# EAGLE design CANMosfetExtension (EAGLE 9.6.2)
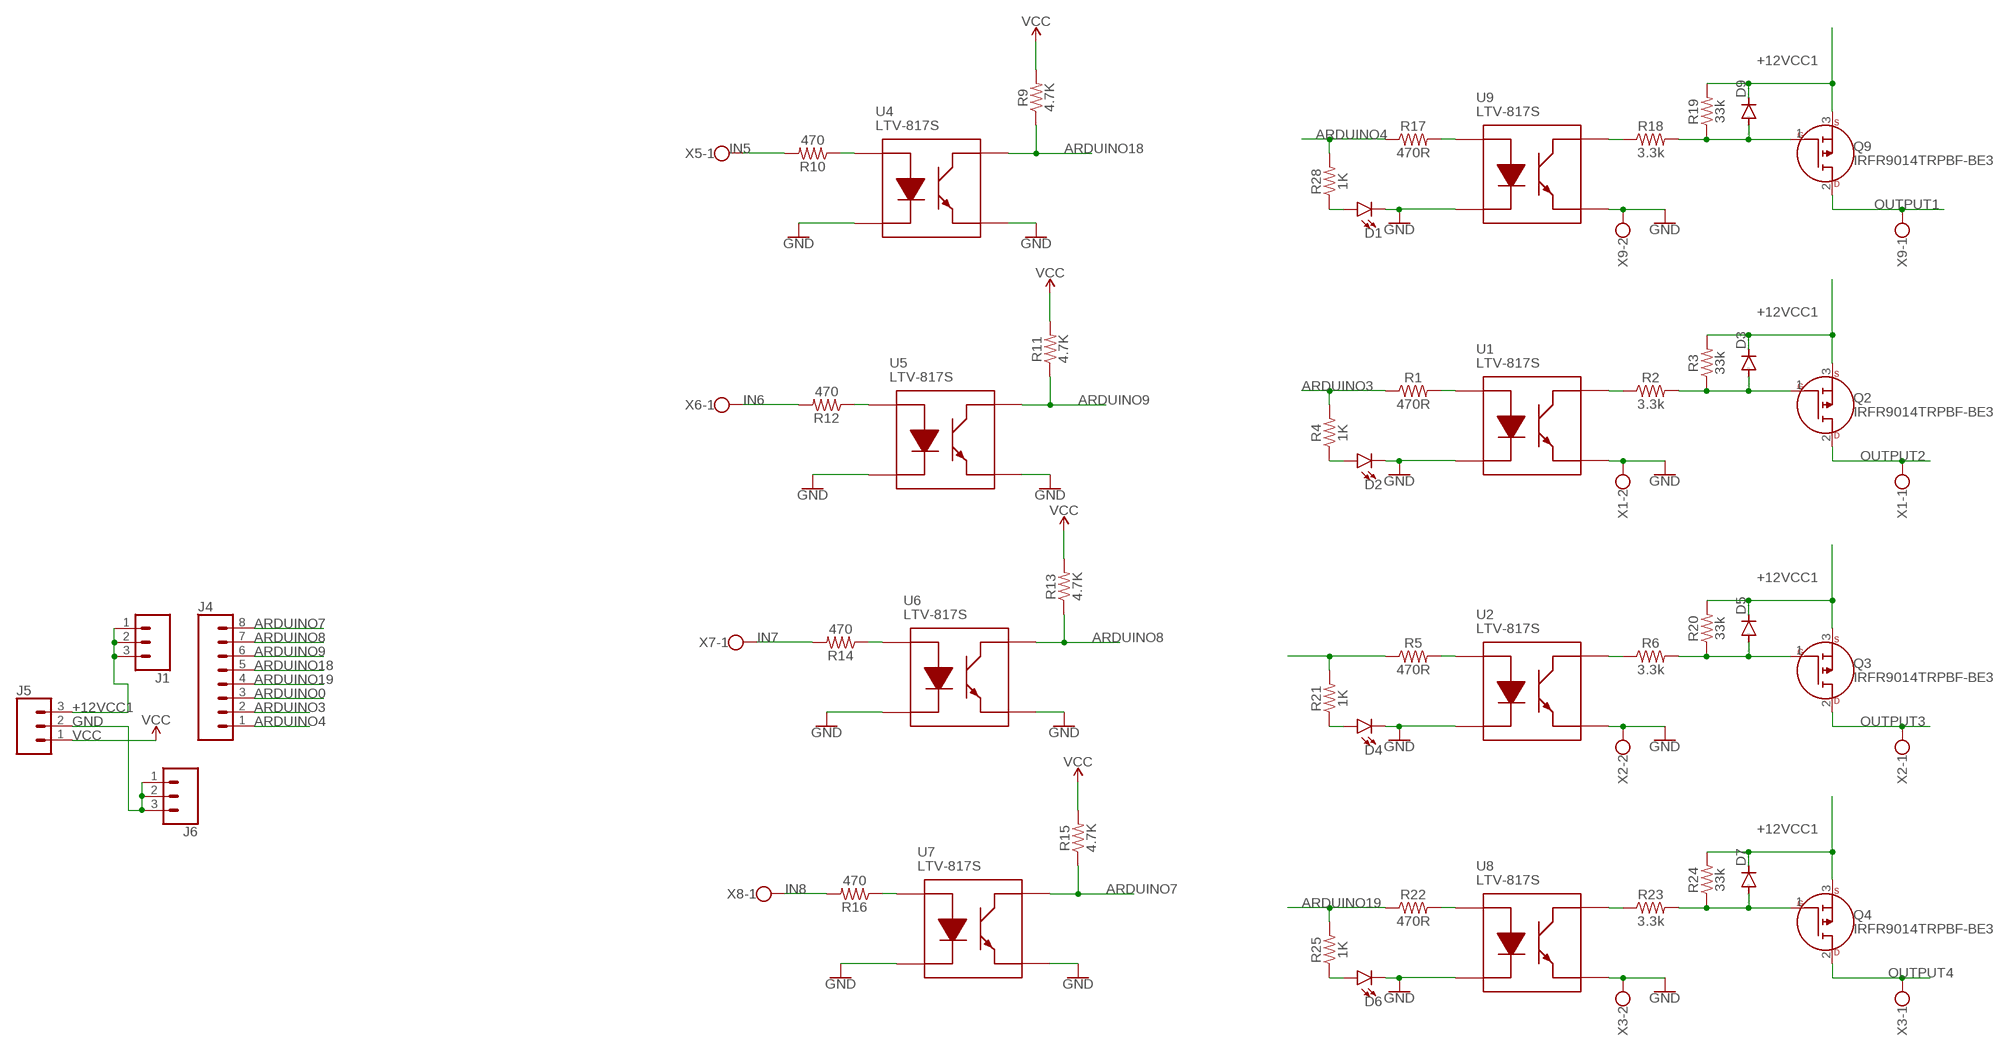
[diagram p0: schematic, sheet 1]

## Parts
D1  LED0603  [LED-0603]
D2  LED0603  [LED-0603]
D3  DIODE-SOD123  [SOD123]
D4  LED0603  [LED-0603]
D5  DIODE-SOD123  [SOD123]
D6  LED0603  [LED-0603]
D7  DIODE-SOD123  [SOD123]
D9  DIODE-SOD123  [SOD123]
J1  CONN_03LOCK  [1X03_LOCK]
J4  CONN_08LOCK  [1X08_LOCK]
J5  CONN_03LOCK  [1X03_LOCK]
J6  CONN_03LOCK  [1X03_LOCK]
Q2  IRFR9014TRPBF-BE3  [IRFR9014TRPBFBE3]
Q3  IRFR9014TRPBF-BE3  [IRFR9014TRPBFBE3]
Q4  IRFR9014TRPBF-BE3  [IRFR9014TRPBFBE3]
Q9  IRFR9014TRPBF-BE3  [IRFR9014TRPBFBE3]
R1  470R  1KOHM-0603-1/10W-1%  [0603]
R2  3.3k  1KOHM-0603-1/10W-1%  [0603]
R3  33k  1KOHM-0603-1/10W-1%  [0603]
R4  1K  1KOHM-0603-1/10W-1%  [0603]
R5  470R  1KOHM-0603-1/10W-1%  [0603]
R6  3.3k  1KOHM-0603-1/10W-1%  [0603]
R9  4.7K  1KOHM-0603-1/10W-1%  [0603]
R10  470  1KOHM-0603-1/10W-1%  [0603]
R11  4.7K  1KOHM-0603-1/10W-1%  [0603]
R12  470  1KOHM-0603-1/10W-1%  [0603]
R13  4.7K  1KOHM-0603-1/10W-1%  [0603]
R14  470  1KOHM-0603-1/10W-1%  [0603]
R15  4.7K  1KOHM-0603-1/10W-1%  [0603]
R16  470  1KOHM-0603-1/10W-1%  [0603]
R17  470R  1KOHM-0603-1/10W-1%  [0603]
R18  3.3k  1KOHM-0603-1/10W-1%  [0603]
R19  33k  1KOHM-0603-1/10W-1%  [0603]
R20  33k  1KOHM-0603-1/10W-1%  [0603]
R21  1K  1KOHM-0603-1/10W-1%  [0603]
R22  470R  1KOHM-0603-1/10W-1%  [0603]
R23  3.3k  1KOHM-0603-1/10W-1%  [0603]
R24  33k  1KOHM-0603-1/10W-1%  [0603]
R25  1K  1KOHM-0603-1/10W-1%  [0603]
R28  1K  1KOHM-0603-1/10W-1%  [0603]
U1  LTV-817S  [SOP254P1016X460-4N]
U2  LTV-817S  [SOP254P1016X460-4N]
U4  LTV-817S  [SOP254P1016X460-4N]
U5  LTV-817S  [SOP254P1016X460-4N]
U6  LTV-817S  [SOP254P1016X460-4N]
U7  LTV-817S  [SOP254P1016X460-4N]
U8  LTV-817S  [SOP254P1016X460-4N]
U9  LTV-817S  [SOP254P1016X460-4N]
X1  W237-102  [W237-102]
X2  W237-102  [W237-102]
X3  W237-102  [W237-102]
X5  W237-102  [W237-102]
X6  W237-102  [W237-102]
X7  W237-102  [W237-102]
X8  W237-102  [W237-102]
X9  W237-102  [W237-102]

## Nets
+12VCC1: D3.C D5.C D7.C D9.C J1.1 J1.2 J1.3 J5.3 Q2.3(D) Q3.3(D) Q4.3(D) Q9.3(D) R3.2 R19.2 R20.2 R24.2
ARDUINO0: J4.3 R5.1 R21.2
ARDUINO3: J4.2 R1.1 R4.2
ARDUINO4: J4.1 R17.1 R28.2
ARDUINO7: J4.8 R15.1 U7.4(COLLECTOR)
ARDUINO8: J4.7 R13.1 U6.4(COLLECTOR)
ARDUINO9: J4.6 R11.1 U5.4(COLLECTOR)
ARDUINO18: J4.5 R9.1 U4.4(COLLECTOR)
ARDUINO19: J4.4 R22.1 R25.2
GND: D1.C D2.C D4.C D6.C J5.2 J6.1 J6.2 J6.3 U1.2(CATHODE) U1.3(EMITTER) U2.2(CATHODE) U2.3(EMITTER) U4.2(CATHODE) U4.3(EMITTER) U5.2(CATHODE) U5.3(EMITTER) U6.2(CATHODE) U6.3(EMITTER) U7.2(CATHODE) U7.3(EMITTER) U8.2(CATHODE) U8.3(EMITTER) U9.2(CATHODE) U9.3(EMITTER) X1.2 X2.2 X3.2 X9.2
IN5: R10.2 X5.1
IN6: R12.2 X6.1
IN7: R14.2 X7.1
IN8: R16.2 X8.1
N$1: R18.1 U9.4(COLLECTOR)
N$2: R1.2 U1.1(ANODE)
N$3: R2.1 U1.4(COLLECTOR)
N$4: R5.2 U2.1(ANODE)
N$5: D3.A Q2.1(G) R2.2 R3.1
N$7: D2.A R4.1
N$8: R10.1 U4.1(ANODE)
N$9: R17.2 U9.1(ANODE)
N$10: R12.1 U5.1(ANODE)
N$11: D9.A Q9.1(G) R18.2 R19.1
N$12: R14.1 U6.1(ANODE)
N$13: R6.1 U2.4(COLLECTOR)
N$14: R16.1 U7.1(ANODE)
N$15: D5.A Q3.1(G) R6.2 R20.1
N$16: D4.A R21.1
N$17: R22.2 U8.1(ANODE)
N$18: R23.1 U8.4(COLLECTOR)
N$19: D7.A Q4.1(G) R23.2 R24.1
N$20: D6.A R25.1
N$33: D1.A R28.1
OUTPUT1: Q9.2(S) X9.1
OUTPUT2: Q2.2(S) X1.1
OUTPUT3: Q3.2(S) X2.1
OUTPUT4: Q4.2(S) X3.1
VCC: J5.1 R9.2 R11.2 R13.2 R15.2
Unconnected: X5.2 X6.2 X7.2 X8.2

## Library data of the parts
D1 D2 D4 D6 = SparkFun-LED:LED: LED (Generic) Standard schematic elements and footprints for 5mm, 3mm, 1206, and 0603 sized LEDs. Generic LEDs with no color specified.
D3 D5 D7 D9 = diode:DIODE-: DIODE
J1 J5 J6 = SparkFun-Connectors:CONN_03: Multi connection point. Often used as Generic Header-pin footprint for 0.1 inch spaced/style header connections On any of the 0.1 inch spaced packages, you can populate with these: Break Away Headers - Straight <https://www.sparkfun.com/products/116> (PRT-00116) Break Away Male Headers - Right Angle <https://www.sparkfun.com/products/553> (PRT-00553) Female Headers <https://www.sparkfun.com/products/115> (PRT-00115) Break Away Headers - Machine Pin <https://www.sparkfun.com/products/117> (PRT-00117) Break Away Female Headers - Swiss Machine Pin <https://www.sparkfun.com/products/743> (PRT-00743) Stackable Header - 3 Pin (Female, 0.1") <https://www.sparkfun.com/products/13875> (PRT-13875) For SCREWTERMINALS and SPRING TERMINALS visit here: Screw Terimnals on SparkFun.com <https://www.sparkfun.com/search/results?term=Screw+Terminals> (5mm/3.5mm/2.54mm spacing) This device is also useful as a general connection point to wire up your design to another part of your project. Our various solder wires solder well into these plated through hole pads. Hook-Up Wire - Assortment (Stranded, 22 AWG) <https://www.sparkfun.com/products/11375> (PRT-11375) Hook-Up Wire - Assortment (Solid Core, 22 AWG) <https://www.sparkfun.com/products/11367> (PRT-11367) View the entire wire category on our website here <https://www.sparkfun.com/categories/141> Special notes: Molex polarized connector foot print use with SKU : PRT-08232 with associated crimp pins and housings.
J4 = SparkFun-Connectors:CONN_08: Multi connection point. Often used as Generic Header-pin footprint for 0.1 inch spaced/style header connections On any of the 0.1 inch spaced packages, you can populate with these: Break Away Headers - Straight <https://www.sparkfun.com/products/116> (PRT-00116) Break Away Male Headers - Right Angle <https://www.sparkfun.com/products/553> (PRT-00553) Female Headers <https://www.sparkfun.com/products/115> (PRT-00115) Break Away Headers - Machine Pin <https://www.sparkfun.com/products/117> (PRT-00117) Break Away Female Headers - Swiss Machine Pin <https://www.sparkfun.com/products/743> (PRT-00743) Arduino Stackable Header - 8 Pin <https://www.sparkfun.com/products/9279> (PRT-09279) For SCREWTERMINALS and SPRING TERMINALS visit here: Screw Terimnals on SparkFun.com <https://www.sparkfun.com/search/results?term=Screw+Terminals> (5mm/3.5mm/2.54mm spacing) This device is also useful as a general connection point to wire up your design to another part of your project. Our various solder wires solder well into these plated through hole pads. Hook-Up Wire - Assortment (Stranded, 22 AWG) <https://www.sparkfun.com/products/11375> (PRT-11375) Hook-Up Wire - Assortment (Solid Core, 22 AWG) <https://www.sparkfun.com/products/11367> (PRT-11367) View the entire wire category on our website here <https://www.sparkfun.com/categories/141> Special notes: Molex polarized connector foot print use with SKU : PRT-08231 with associated crimp pins and housings. 1MM SMD Version SKU: PRT-10208 NOTES ON THE VARIANTS LOCK and LOCK_LONGPADS... This footprint was designed to help hold the alignment of a through-hole component (i.e. 6-pin header) while soldering it into place. You may notice that each hole has been shifted either up or down by 0.005 of an inch from it's more standard position (which is a perfectly straight line). This slight alteration caused the pins (the squares in the middle) to touch the edges of the holes. Because they are alternating, it causes a "brace" to hold the component in place. 0.005 has proven to be the perfect amount of "off-center" position when using our standard breakaway headers. Although looks a little odd when you look at the bare footprint, once you have a header in there, the alteration is very hard to notice. Also,if you push a header all the way into place, it is covered up entirely on the bottom side.
Q2-Q4 Q9 = SamacSys_Parts:IRFR9014TRPBF-BE3: MOSFET 60V P-CH HEXFET MOSFET D Source: Datasheet; DESCRIPTION: MOSFET 60V P-CH HEXFET MOSFET D; HEIGHT: 2.38mm; MANUFACTURER_NAME: Vishay; MANUFACTURER_PART_NUMBER: IRFR9014TRPBF-BE3; MOUSER_PART_NUMBER: 78-IRFR9014TRPBF-BE3; MOUSER_PRICE-STOCK: https://www.mouser.co.uk/ProductDetail/Vishay-Siliconix/IRFR9014TRPBF-BE3?qs=7MVldsJ5UaztV2jQZzH2pA%3D%3D
R1-R6 R9-R25 R28 = SparkFun-Resistors:1KOHM: 1kΩ resistor A resistor is a passive two-terminal electrical component that implements electrical resistance as a circuit element. Resistors act to reduce current flow, and, at the same time, act to lower voltage levels within circuits. - Wikipedia; PROD_ID: RES-07856; VALUE: 1k
U1 U2 U4-U9 = SamacSys_Parts:LTV-817S: Optocoupler Transistor Output, 35V, SMD4 Lite-On LTV-817S DC Input Transistor Output Optocoupler, Surface Mount, 4-Pin SMD Source: Datasheet <http://optoelectronics.liteon.com/upload/download/DS-70-96-0016/LTV-8X7 series 201610 .pdf>; DESCRIPTION: Optocoupler Transistor Output, 35V, SMD4 Lite-On LTV-817S DC Input Transistor Output Optocoupler, Surface Mount, 4-Pin SMD; HEIGHT: 4.6mm; MANUFACTURER_NAME: Lite-On; MANUFACTURER_PART_NUMBER: LTV-817S; MOUSER_PART_NUMBER: 859-LTV-817S; MOUSER_PRICE-STOCK: https://www.mouser.co.uk/ProductDetail/Lite-On/LTV-817S?qs=XpF7qU%252BvLkWYeWEC0OckNQ%3D%3D
X1-X3 X5-X9 = con-wago-500:W237-102: WAGO SCREW CLAMP; MPN: 237-102; OC_FARNELL: unknown; OC_NEWARK: 70K9898

## Net classes
0 default: width 0.305 mm

## Board
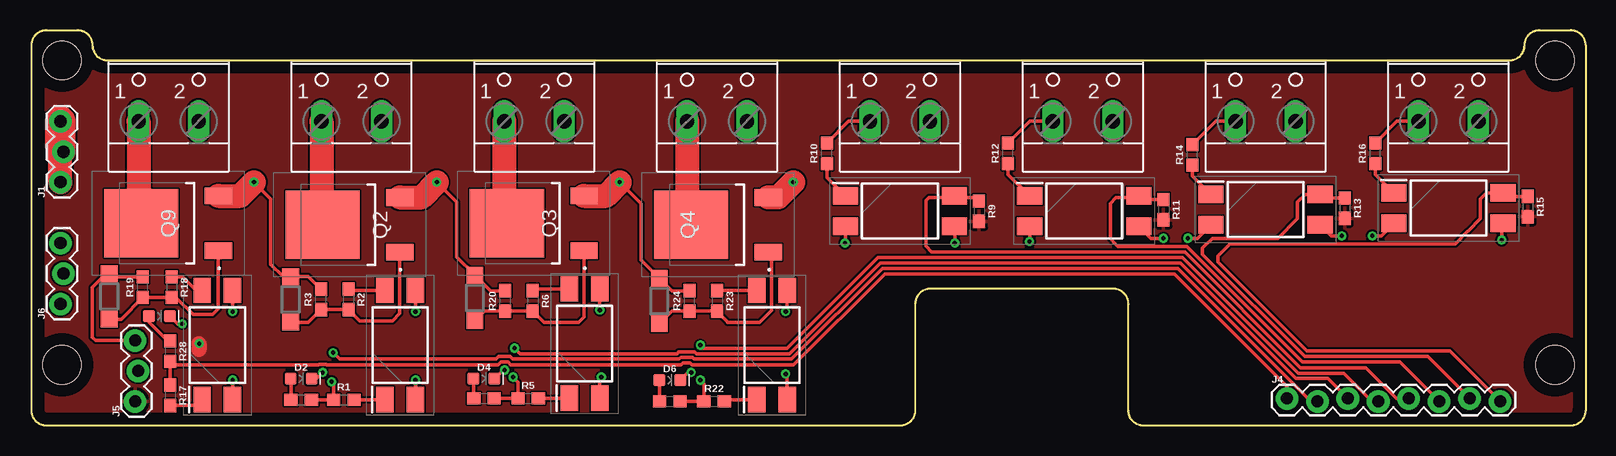
[diagram p1: board, top side]
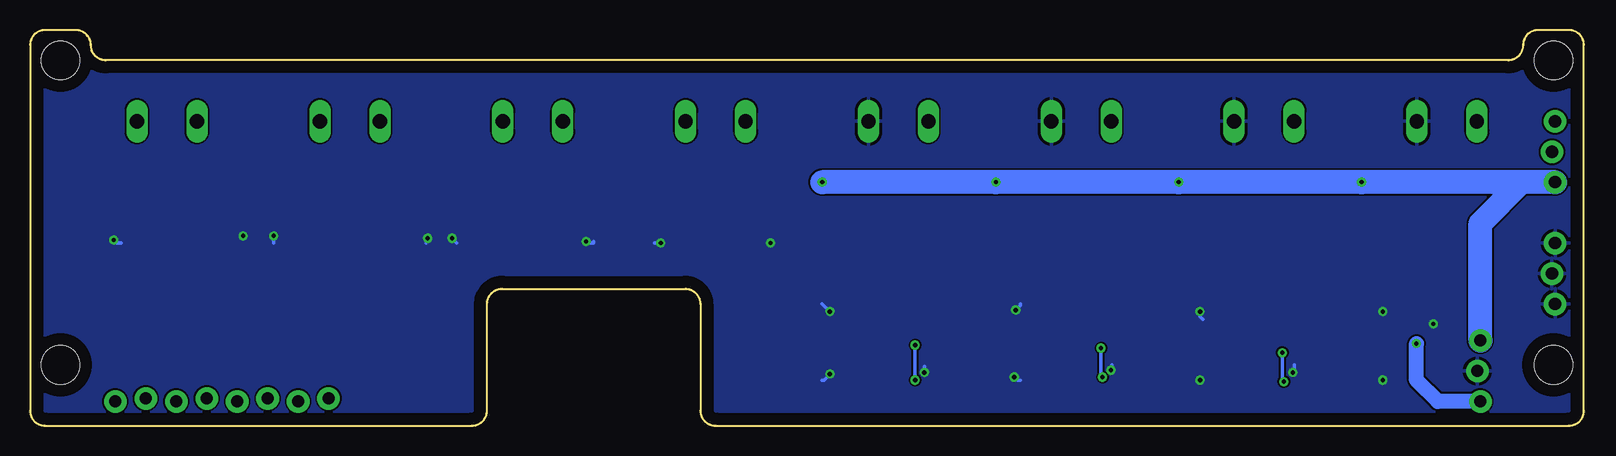
[diagram p2: board, bottom side, seen from below]

Size 129.54 x 33.02 mm. Coordinates in mm from the lower left corner, seen from the top.
Outline: 72.39,0 1.27,0 arc-90 0,1.27 0,31.75 arc-90 1.27,33.02 3.81,33.02 arc-90 5.08,31.75 arc90 6.35,30.48 123.19,30.48 arc90 124.46,31.75 arc-90 125.73,33.02 128.27,33.02 arc-90 129.54,31.75 129.54,1.27 arc-90 128.27,0 92.71,0 arc-90 91.44,1.27 91.44,10.16 arc90 90.17,11.43 74.93,11.43 arc90 73.66,10.16 73.66,1.27 arc-90 72.39,0
Copper layers (1*16): Top 0.035mm / dielectric 1.5mm / Bottom 0.035mm
Design rules "default": minimum track width 6mil, minimum drill 0.35mm, track to track 6mil, track to pad 6mil, pad to pad 6mil, via to via 6mil, smd to smd 6mil, copper to edge 40mil, drill to drill 6mil, minimum pad ring 10mil, minimum via ring 8mil, stop-mask expansion 4mil, vias tented up to drill 0mil, thermal gap 10mil
Holes 3.2 mm at 2.54,30.48 2.54,5.08 127,5.08 127,30.48

### Footprints (pad centres in the part's own frame; a part is rotated, then mirrored left to right if it is on the bottom)
LED-0603 = smd 1 x 1: A -0.877,0; C 0.877,0
SOD123 = smd 1.4 x 1.4: A 1.9,0; C -1.9,0
1X03_LOCK = drill 1.016 pad 1.88: 1 0,0.127; 2 2.54,-0.127; 3 5.08,0.127
1X08_LOCK = drill 1.016 pad 1.88: 1 0,0.127; 2 2.54,-0.127; 3 5.08,0.127; 4 7.62,-0.127; 5 10.16,0.127; 6 12.7,-0.127; 7 15.24,0.127; 8 17.78,-0.127
IRFR9014TRPBFBE3 = smd 1.397 x 2.286: 1 -2.286,-6.435; 3 2.286,-6.435 | smd 5.69 x 6.18: 2 0,0
0603 = smd 1.1 x 1: 1 -0.85,0; 2 0.85,0
SOP254P1016X460-4N = smd 2.1 x 1.45: 1 -4.55,1.27; 2 -4.55,-1.27; 3 4.55,-1.27; 4 4.55,1.27
W237-102 = drill 1.194 long: 1 -2.5,-1.27; 2 2.5,-1.27

### Placement (x,y rotation side)
D1  10.67,9.14 0 top
D2  22.48,3.94 0 top
D3  21.59,10.54 270 top
D4  37.72,3.94 0 top
D5  36.96,10.67 270 top
D6  53.21,3.81 0 top
D7  52.32,10.41 270 top
D9  6.48,10.79 270 top
J1  2.54,20.32 90 top
J4  104.65,2.16 0 top
J5  8.76,2.03 90 top
J6  2.54,10.16 90 top
Q2  24.26,16.76 90 top
Q3  39.62,16.89 90 top
Q4  54.99,16.76 90 top
Q9  9.14,16.89 90 top
R1  26.04,2.16 0 top
R2  26.42,10.54 270 top
R3  24.13,10.54 90 top
R4  22.48,2.16 0 top
R5  41.4,2.29 0 top
R6  41.78,10.41 270 top
R9  78.99,17.91 270 top
R10  66.29,22.73 90 top
R11  94.36,18.03 270 top
R12  81.41,22.73 90 top
R13  109.47,18.16 270 top
R14  96.77,22.61 90 top
R15  124.71,18.29 270 top
R16  112.01,22.73 90 top
R17  11.56,2.54 270 top
R18  11.68,11.56 270 top
R19  9.27,11.56 90 top
R20  39.5,10.41 90 top
R21  37.72,2.29 0 top
R22  56.9,2.03 0 top
R23  57.15,10.41 270 top
R24  54.86,10.41 90 top
R25  53.21,2.03 0 top
R28  11.56,6.22 270 top
U1  30.73,6.73 90 top
U2  46.1,6.86 90 top
U4  72.39,17.91 0 top
U5  87.76,17.91 0 top
U6  102.87,18.03 0 top
U7  118.11,18.16 0 top
U8  61.72,6.73 90 top
U9  15.49,6.73 90 top
X1  26.67,26.67 0 top
X2  41.91,26.67 0 top
X3  57.15,26.67 0 top
X5  72.39,26.67 0 top
X6  87.63,26.67 0 top
X7  102.87,26.67 0 top
X8  118.11,26.67 0 top
X9  11.43,26.67 0 top

### Tracks (layer width: path | path; a pad name or v marks a point on that pad's centre or on a via)
+12VCC1  (via drill 0.35)
  Top 0.305: 6.6,12.57 6.77,12.41 R19.2 9.02,12.66 | 6.6,12.57 D9.C | R3.2 23.08,12.44 D3.C 20.96,12.44 19.94,13.46 19.94,18.92 v18.54,20.32 | R20.2 38.26,11.26 D5.C 35.43,14.09 35.43,18.67 v33.78,20.32 | R24.2 53.37,11.26 D7.C 50.8,13.84 50.8,18.54 v49.02,20.32 | J5.3 5.33,7.11 5.08,7.37 5.08,11.56 6.09,12.57 6.6,12.57
  Top 2: J1.1 2.41,22.61 J1.2 2.41,23.11 J1.3 | v63.5,20.32 62.23,19.05 Q4.3 | Q3.3 47.88,19.18 v49.02,20.32 | Q2.3 32.51,19.05 v33.78,20.32 | Q9.3 17.4,19.18 v18.54,20.32
  Top 2.54: J1.3 2.41,23.37
  Bottom 2: J5.3 8.64,16.89 5.21,20.32 J1.1 v18.54,20.32 v33.78,20.32 v49.02,20.32 v63.5,20.32
ARDUINO0  (via drill 0.35)
  Top 0.305: J4.3 108.08,3.94 105.4,3.94 95.75,13.59 70.75,13.59 63.18,6.02 55.42,6.02 55.27,6.17 53.95,6.17 53.8,6.02 40.72,6.02 v40.26,6.48 | v40.13,4.06 40.55,3.64 R5.1 R21.2
  Bottom 0.305: v40.26,6.48 40.26,4.19 v40.13,4.06
ARDUINO3  (via drill 0.35)
  Top 0.305: J4.2 106.66,2.03 95.56,13.13 70.94,13.13 63.37,5.56 55.23,5.56 55.08,5.71 54.14,5.71 53.99,5.56 40.12,5.56 39.9,5.78 38.95,5.78 38.73,5.56 25.68,5.56 v25.15,6.1 | v25.02,3.68 25.18,3.52 R1.1 R4.2
  Bottom 0.305: v25.15,6.1 25.15,3.81 v25.02,3.68
ARDUINO4
  Top 0.305: J4.1 104.65,3.3 95.28,12.68 71.13,12.68 63.54,5.08 55.07,5.08 54.89,5.26 54.33,5.26 54.15,5.08 39.95,5.08 39.71,5.33 39.14,5.33 38.9,5.08 24.59,5.08 24.54,5.13 23.97,5.13 23.93,5.08 11.85,5.08 R28.2 R17.1
ARDUINO7
  Top 0.305: J4.8 118.21,6.25 106.33,6.25 98.9,13.67 98.9,14.16 99.9,15.16 118.67,15.16 119.7,16.19 119.76,16.26 120.78,17.27 120.78,18.92 121.29,19.43 U7.4 122.73,19.36 122.95,19.14 R15.1
ARDUINO8
  Top 0.305: J4.7 116.38,5.79 106.14,5.79 97.62,14.31 97.62,14.82 98.42,15.62 103.89,15.62 105.54,17.27 105.54,18.67 106.17,19.3 U6.4 107.71,19.01 R13.1
ARDUINO9
  Top 0.305: J4.6 114.05,5.33 105.95,5.33 96.32,14.96 90.58,14.96 90.23,15.3 90.04,15.49 89.92,15.62 89.92,18.54 90.41,19.04 92.45,19.04 | R11.1 92.6,18.88 92.45,19.04 | 92.45,19.04 U5.4
ARDUINO18
  Top 0.305: J4.5 113.77,2.29 111.21,4.85 105.78,4.85 96.13,14.5 75.03,14.5 74.55,14.99 74.55,18.8 74.8,19.05 76.2,19.05 | R9.1 78.7,19.05 76.84,19.05 76.2,19.05 | 76.2,19.05 76.33,19.18 U4.4
ARDUINO19  (via drill 0.35)
  Top 0.305: J4.4 111.74,2.03 109.38,4.39 105.59,4.39 95.94,14.05 70.56,14.05 62.99,6.48 56.01,6.48 v55.75,6.73 | v55.75,3.81 56.05,3.52 R22.1 R25.2
  Bottom 0.305: v55.75,6.73 v55.75,3.81
GND  (via drill 0.35)
  Top 0.305: U4.2 67.84,15.26 v67.82,15.24 | U4.3 76.96,16.62 v76.96,15.24 | U5.2 83.21,15.39 v83.19,15.37 | U5.3 93.3,15.64 v94.36,15.64 | U6.2 97.2,15.64 v96.39,15.64 | U6.3 108.34,15.85 v109.22,15.85 | U7.2 112.52,15.85 v111.76,15.85 | U7.3 122.56,16.79 v122.56,15.49 | D1.C 12.18,8.51 v12.57,8.51 | U9.3 v16.76,9.53 | U9.2 v16.76,3.81 | D2.C 23.75,3.94 v24.26,4.45 | U1.2 v32,3.81 | U1.3 v32,9.53 | U2.3 v47.37,9.65 | D4.C 39.3,4.64 v39.43,4.64 | U2.2 47.37,3.94 v47.5,4.06 | U8.2 62.99,4.19 v62.87,4.32 | U8.3 62.99,9.65 v62.87,9.53 | D6.C 54.72,4.45 v54.99,4.45
  Bottom 0.305: v76.96,15.24 77.47,15.24 | v83.19,15.37 83.06,15.24 82.55,15.24 82.55,15.37 | v94.36,15.64 94.36,15.62 93.98,15.24 | v96.39,15.64 96.52,15.52 96.52,15.24 | v109.22,15.85 109.22,15.24 | v111.76,15.85 111.66,15.75 111.63,15.75 | v122.56,15.49 122.3,15.24 121.92,15.24 | v16.76,3.81 16.51,3.81 | v24.26,4.45 24.13,4.57 24.13,5.08 | v32,9.53 32,9.14 31.75,8.89 | v47.37,9.65 46.99,10.03 46.99,10.16 | v39.43,4.64 39.37,4.7 39.37,5.08 | v47.5,4.06 47.24,3.81 46.99,3.81 | v54.99,4.45 54.99,4.95 | v62.87,4.32 63.37,3.81 63.5,3.81 | v62.87,9.53 63.5,10.16
  pour Bottom: 0,33.02 129.54,33.02 129.54,0 0,0
IN5
  Top 0.305: R10.2 68.11,25.4 X5.1
IN6
  Top 0.305: R12.2 83.22,25.4 X6.1
IN7
  Top 0.305: R14.2 98.72,25.4 X7.1
IN8
  Top 0.305: R16.2 113.83,25.4 X8.1
N$1
  Top 0.305: U9.4 13.74,11.28 12.61,12.41 R18.1
N$2
  Top 0.305: U1.1 26.91,2.18 R1.2
N$3
  Top 0.305: U1.4 26.53,11.28 R2.1
N$4
  Top 0.305: R5.2 44.81,2.29 U2.1
N$5
  Top 0.305: Q2.1 30.69,9.36 30.1,8.76 27.34,8.76 R2.2 R3.1 23.08,8.64 D3.A
N$7
  Top 0.305: R4.1 21.63,3.91 D2.A
N$8
  Top 0.305: U4.1 66.29,20.72 R10.1
N$9
  Top 0.305: U9.1 13.73,1.69 R17.2
N$10
  Top 0.305: U5.1 81.41,20.98 R12.1
N$11
  Top 0.305: D9.A 7.46,8.89 R19.1 10.16,10.71 R18.2 12.03,10.71 13.46,9.27 15.11,9.27 15.58,9.74 Q9.1
N$12
  Top 0.305: U6.1 96.77,20.85 R14.1
N$13
  Top 0.305: U2.4 41.93,11.41 R6.1
N$14
  Top 0.305: U7.1 112.01,20.98 R16.1
N$15
  Top 0.305: Q3.1 46.06,9.1 45.59,8.64 42.71,8.64 R6.2 R20.1 37.75,9.56 D5.A
N$16
  Top 0.305: R21.1 36.87,3.91 D4.A
N$17
  Top 0.305: U8.1 57.89,2.18 R22.2
N$18
  Top 0.305: R23.1 57.17,11.28 U8.4
N$19
  Top 0.305: D7.A 53.37,9.56 R24.1 R23.2 58.04,8.68 58.04,8.64 60.71,8.64 61.68,9.61 61.68,14.22 Q4.1
N$20
  Top 0.305: R25.1 52.36,3.78 D6.A
N$33
  Top 0.305: R28.1 11.34,7.07 9.79,8.62 D1.A
OUTPUT1
  Top 2: X9.1 8.93,16.55 8.89,16.51 7.62,17.78 8.26,17.78 Q9.2
OUTPUT2
  Top 2: X1.1 24.17,16.55 | 24.17,16.55 24.13,16.51 | Q2.2 24.26,16.64 24.17,16.55
OUTPUT3
  Top 2: X2.1 39.41,17.11 Q3.2
OUTPUT4
  Top 2: X3.1 54.65,16.55 54.61,16.51 54.74,16.51 Q4.2
VCC  (via drill 0.35)
  Top 1.27: v13.97,6.86 13.97,6.35
  Bottom 1.27: J5.1 12.19,2.03 13.97,3.81 v13.97,6.86
  pour Top: 129.54,33.02 0,33.02 0,0 129.54,0